# EAGLE design robocon_task1 (EAGLE 9.5.2)
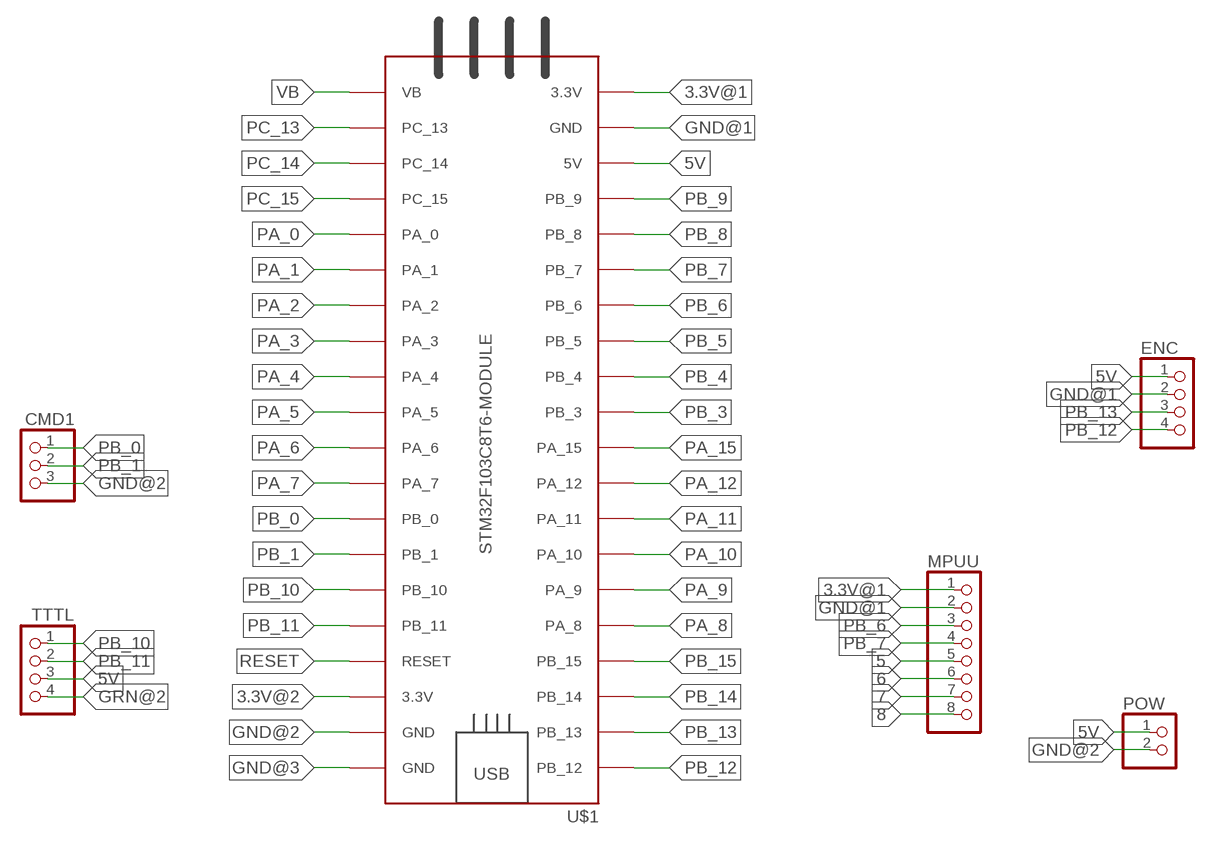
[diagram p0: schematic, sheet 1]

## Parts
CMD1  PINHD-1X3  [1X03]
ENC  PINHD-1X4  [1X04]
MPUU  PINHD-1X8  [1X08]
POW  PINHD-2_DATA  [1X02_DATA]
TTTL  PINHD-4_DATA  [1X04_DATA]
U$1  STM32F103C8T6-MODULE  [STM32F103C8T6-MODULE]

## Nets
3.3V@1: MPUU.1 U$1.3.3V_1(3.3V)
3.3V@2: U$1.3.3V_2(3.3V)
5: MPUU.5
5V: ENC.1 POW.1 TTTL.3 U$1.5V
6: MPUU.6
7: MPUU.7
8: MPUU.8
GND@1: ENC.2 MPUU.2 U$1.GND_1(GND)
GND@2: CMD1.3 POW.2 U$1.GND_2(GND)
GND@3: U$1.GND_3(GND)
GRN@2: TTTL.4
PA_0: U$1.PA_0
PA_1: U$1.PA_1
PA_2: U$1.PA_2
PA_3: U$1.PA_3
PA_4: U$1.PA_4
PA_5: U$1.PA_5
PA_6: U$1.PA_6
PA_7: U$1.PA_7
PA_8: U$1.PA_8
PA_9: U$1.PA_9
PA_10: U$1.PA_10
PA_11: U$1.PA_11
PA_12: U$1.PA_12
PA_15: U$1.PA_15
PB_0: CMD1.1 U$1.PB_0
PB_1: CMD1.2 U$1.PB_1
PB_3: U$1.PB_3
PB_4: U$1.PB_4
PB_5: U$1.PB_5
PB_6: MPUU.3 U$1.PB_6
PB_7: MPUU.4 U$1.PB_7
PB_8: U$1.PB_8
PB_9: U$1.PB_9
PB_10: TTTL.1 U$1.PB_10
PB_11: TTTL.2 U$1.PB_11
PB_12: ENC.4 U$1.PB_12
PB_13: ENC.3 U$1.PB_13
PB_14: U$1.PB_14
PB_15: U$1.PB_15
PC_13: U$1.PC_13
PC_14: U$1.PC_14
PC_15: U$1.PC_15
RESET: U$1.RESET
VB: U$1.VB

## Library data of the parts
CMD1 = MIA_LIBRARY-2-2-2:PINHD-1X3: PIN HEADER
ENC = MIA_LIBRARY-2-2-2:PINHD-1X4: PIN HEADER
MPUU = MIA_LIBRARY-2-2-2:PINHD-1X8: PIN HEADER
POW = MIA_LIBRARY-2-2-2:PINHD-2_DATA: PIN HEADER
TTTL = MIA_LIBRARY-2-2-2:PINHD-4_DATA: PIN HEADER
U$1 = MIA_LIBRARY-2-2-2:STM32F103C8T6-MODULE: STM32F103C8T6 module with ARM Cortex-3, 20kB SRAM, 64kB Flash, 72MHz

## Board
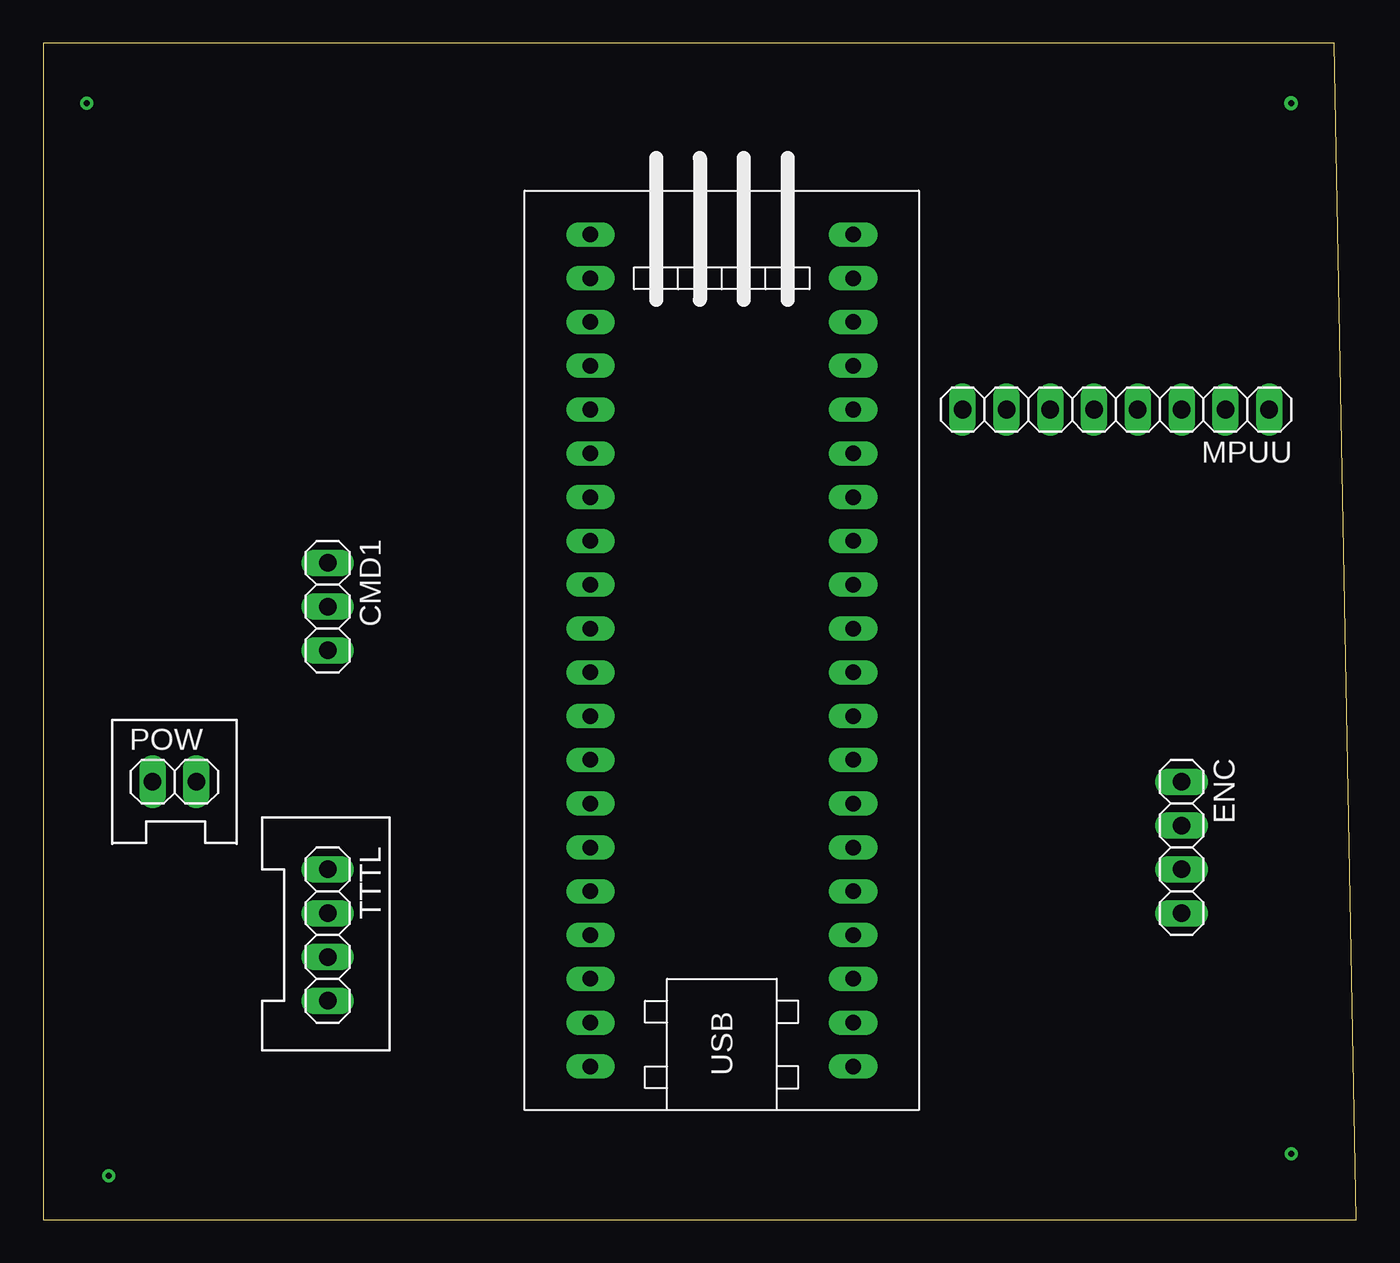
[diagram p1: board, top side]
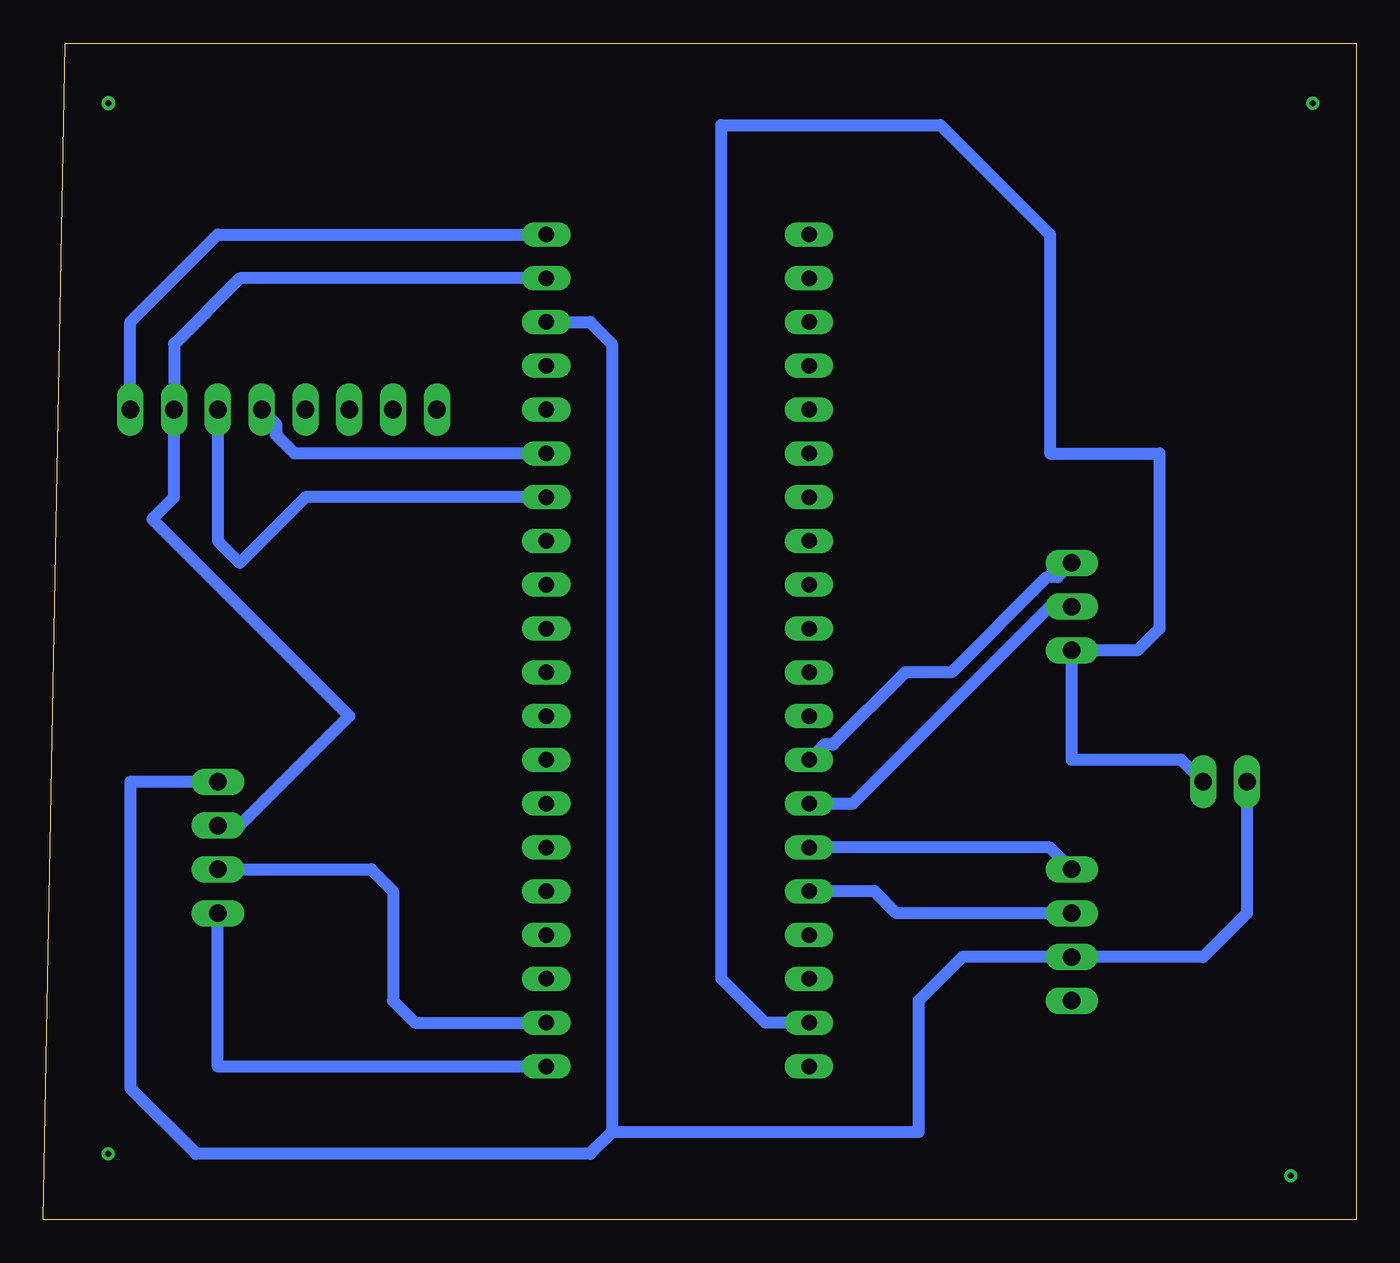
[diagram p2: board, bottom side, seen from below]

Size 76.18 x 68.25 mm. Coordinates in mm from the lower left corner, seen from the top.
Outline: 0,0 76.18,0 74.91,68.25 0,68.25 0,0
Copper layers (1*16): Top 0.035mm / dielectric 1.5mm / Bottom 0.035mm
Design rules "default *": minimum track width 0.7mm, minimum drill 0.35mm, track to track 0.6mm, track to pad 0.6mm, pad to pad 0.6mm, via to via 6mil, smd to smd 6mil, copper to edge 0.2mm, drill to drill 0.2mm, minimum pad ring 10mil, minimum via ring 8mil, stop-mask expansion 4mil, vias tented up to drill 0mil, thermal gap 10mil

### Footprints (pad centres in the part's own frame; a part is rotated, then mirrored left to right if it is on the bottom)
1X03 = drill 1.016 long: 1 -2.54,0; 2 0,0; 3 2.54,0
1X04 = drill 1.016 long: 1 -3.81,0; 2 -1.27,0; 3 1.27,0; 4 3.81,0
1X08 = drill 1.016 long: 1 -8.89,0; 2 -6.35,0; 3 -3.81,0; 4 -1.27,0; 5 1.27,0; 6 3.81,0; 7 6.35,0; 8 8.89,0
1X02_DATA = drill 1.016 long: 1 -1.27,0; 2 1.27,0
1X04_DATA = drill 1.016 long: 1 -3.81,0; 2 -1.27,0; 3 1.27,0; 4 3.81,0
STM32F103C8T6-MODULE = drill 0.9 long: 3.3V_1 25.4,-7.62; 3.3V_2 -17.78,7.62; 5V 20.32,-7.62; GND_1 22.86,-7.62; GND_2 -20.32,7.62; GND_3 -22.86,7.62; PA_0 15.24,7.62; PA_1 12.7,7.62; PA_2 10.16,7.62; PA_3 7.62,7.62; PA_4 5.08,7.62; PA_5 2.54,7.62; PA_6 0,7.62; PA_7 -2.54,7.62; PA_8 -12.7,-7.62; PA_9 -10.16,-7.62; PA_10 -7.62,-7.62; PA_11 -5.08,-7.62; PA_12 -2.54,-7.62; PA_15 0,-7.62; PB_0 -5.08,7.62; PB_1 -7.62,7.62; PB_3 2.54,-7.62; PB_4 5.08,-7.62; PB_5 7.62,-7.62; PB_6 10.16,-7.62; PB_7 12.7,-7.62; PB_8 15.24,-7.62; PB_9 17.78,-7.62; PB_10 -10.16,7.62; PB_11 -12.7,7.62; PB_12 -22.86,-7.62; PB_13 -20.32,-7.62; PB_14 -17.78,-7.62; PB_15 -15.24,-7.62; PC_13 22.86,7.62; PC_14 20.32,7.62; PC_15 17.78,7.62; RESET -15.24,7.62; VB 25.4,7.62

### Placement (x,y rotation side)
CMD1  16.51,35.56 270 top
ENC  66.04,21.59 270 top
MPUU  62.23,46.99 180 top
POW  7.62,25.4 0 top
TTTL  16.51,16.51 270 top
U$1  39.37,31.75 90 top

### Tracks (layer width: path | path; a pad name or v marks a point on that pad's centre or on a via)
3.3V@1
  Bottom 0.7: MPUU.1 71.12,52.07 66.04,57.15 U$1.3.3V_1
5V
  Bottom 0.7: POW.1 6.35,17.78 8.89,15.24 TTTL.3 22.86,15.24 25.4,12.7 25.4,5.08 43.18,5.08 | ENC.1 71.12,25.4 71.12,7.62 67.31,3.81 44.45,3.81 43.18,5.08 | U$1.5V 44.45,52.07 43.18,50.8 43.18,5.08
GND@1
  Bottom 0.7: U$1.GND_1 64.77,54.61 68.58,50.8 MPUU.2 68.58,41.91 69.85,40.64 58.42,29.21 64.77,22.86 ENC.2
GND@2
  Bottom 0.7: POW.2 10.16,26.67 16.51,26.67 CMD1.3 12.7,33.02 11.43,34.29 11.43,44.45 17.78,44.45 17.78,57.15 24.13,63.5 36.83,63.5 36.83,13.97 34.29,11.43 U$1.GND_2
N$1  (via drill 0.35)
  other vias: 2.54,64.77
N$2  (via drill 0.35)
  other vias: 3.81,2.54
N$3  (via drill 0.35)
  other vias: 72.39,3.81
N$4  (via drill 0.35 pad 0.8)
  other vias: 72.39,64.77
PB_0
  Bottom 0.7: CMD1.1 17.34,37.27 17.98,37.27 23.5,31.75 26.17,31.75 30.36,27.56 30.86,27.56 U$1.PB_0
PB_1
  Bottom 0.7: U$1.PB_1 29.21,24.13 17.78,35.56 CMD1.2
PB_6
  Bottom 0.7: MPUU.3 66.04,39.37 64.77,38.1 60.96,41.91 U$1.PB_6
PB_7
  Bottom 0.7: MPUU.4 62.67,46.16 62.67,45.52 61.6,44.45 U$1.PB_7
PB_10
  Bottom 0.7: TTTL.1 17.78,21.59 U$1.PB_10
PB_11
  Bottom 0.7: U$1.PB_11 27.94,19.05 26.67,17.78 TTTL.2
PB_12
  Bottom 0.7: U$1.PB_12 66.04,8.89 ENC.4
PB_13
  Bottom 0.7: ENC.3 57.15,20.32 55.88,19.05 55.88,12.7 54.61,11.43 U$1.PB_13